# EAGLE design placa_alimentacao (EAGLE 9.1.3)
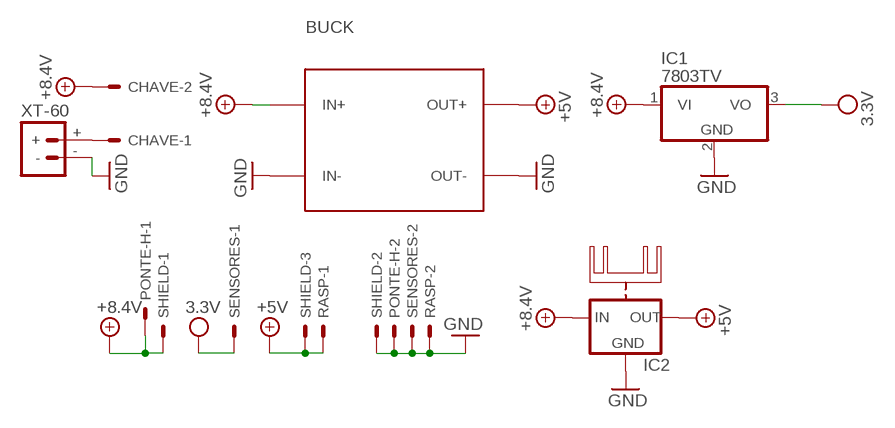
[diagram p0: schematic, sheet 1]

## Parts
BUCK  DC-DC-STEP-DOWN-LM2596  [DC-DC-STEP-DOWN-LM2596]
CHAVE  CONN_0227-2021  [6410-02]
IC1  7803TV  7805TV  [TO220V]
IC2  78XXH  [78XXH]
PONTE-H  CONN_0227-2021  [6410-02]
RASP  CONN_0227-2021  [6410-02]
SENSORES  CONN_0227-2021  [6410-02]
SHIELD  CONN_0327-2031  [6410-03]
XT-60  BATTERY_CONNXT60  [XT60]

## Nets
+5V: BUCK.OUT+ IC2.OUT RASP.1 SHIELD.3
+8V: BUCK.IN+ CHAVE.2 IC1.1(VI) IC2.IN PONTE-H.1 SHIELD.1 ; supply symbol labelled +8.4V
GND: BUCK.IN- BUCK.OUT- IC1.2(GND) IC2.GND PONTE-H.2 RASP.2 SENSORES.2 SHIELD.2 XT-60.-
N$1: CHAVE.1 XT-60.+
VCC: IC1.3(VO) SENSORES.1 ; supply symbol labelled 3.3V

## Library data of the parts
BUCK = Robotica-IFRN-SC-powerModulos:DC-DC-STEP-DOWN-LM2596: DC/DC Step-Down Regulator based on LM2596-ADJ chip
CHAVE PONTE-H RASP SENSORES = Robotica-IFRN-SC-conectores:CONN_02: CONNECTOR wire to board 2.54 mm (.1 inch) pitch header; OC_FARNELL: unknown; OC_NEWARK: unknown
IC1 = linear:78*: Positive VOLTAGE REGULATOR Source: http://cache.national.com/ds/LM/LM78L05.pdf http://www.fairchildsemi.com/ds/LM/LM7805.pdf
IC2 = 78xx_with_heatsink:78XXH: VOLTAGE REGULATOR
SHIELD = Robotica-IFRN-SC-conectores:CONN_03: CONNECTOR wire to board 2.54 mm (.1 inch) pitch header; OC_FARNELL: unknown; OC_NEWARK: unknown
XT-60 = Robotica-IFRN-SC-conectores:BATTERY_CONN: Battery Connectors Various footprints for battery connections

## Board
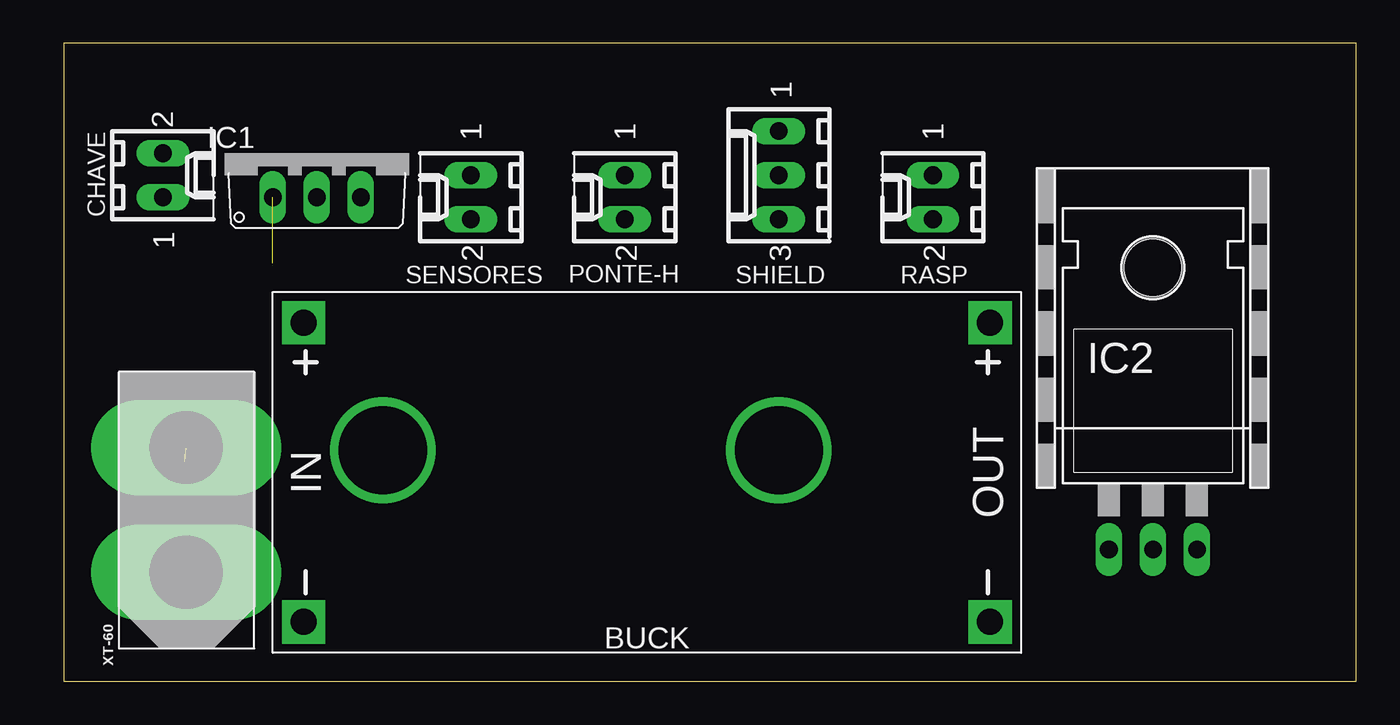
[diagram p1: board, top side]
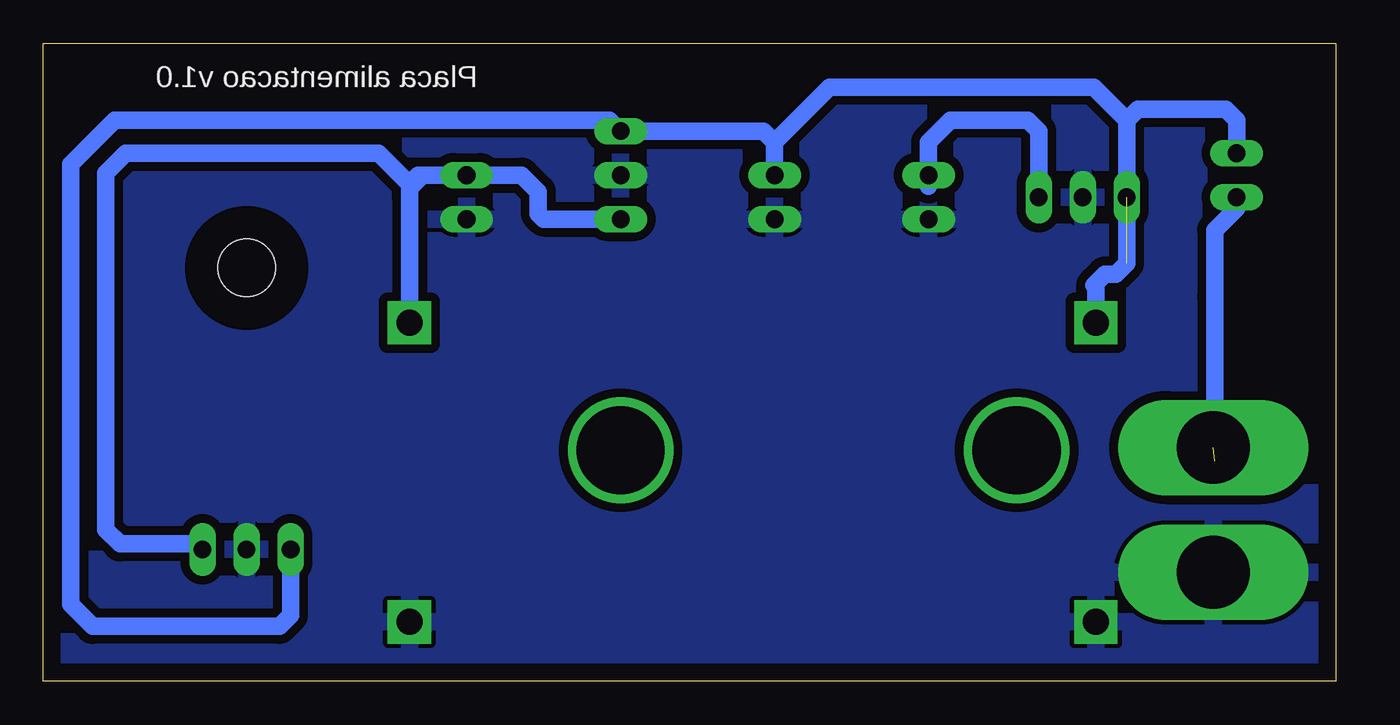
[diagram p2: board, bottom side, seen from below]

Size 74.6 x 36.82 mm. Coordinates in mm from the lower left corner, seen from the top.
Outline: 0,0 74.6,0 74.6,36.82 0,36.82 0,0
Copper layers (1*16): Top 0.035mm / dielectric 1.5mm / Bottom 0.035mm
Design rules "default *": minimum track width 40mil, minimum drill 24mil, track to track 20mil, track to pad 20mil, pad to pad 20mil, via to via 20mil, smd to smd 8mil, copper to edge 40mil, drill to drill 8mil, minimum pad ring 10mil, minimum via ring 8mil, stop-mask expansion 4mil, vias tented up to drill 0mil, thermal gap 10mil

### Footprints (pad centres in the part's own frame; a part is rotated, then mirrored left to right if it is on the bottom)
DC-DC-STEP-DOWN-LM2596 = drill 1.5 pad 2.5 square: IN+ -19.812,8.636; IN- -19.812,-8.636; OUT+ 19.812,8.636; OUT- 19.812,-8.636
6410-02 = drill 1.016 long: 1 1.27,0; 2 -1.27,0
TO220V = drill 1.016 long: 1 -2.54,-2.54; 2 0,-2.54; 3 2.54,-2.54
78XXH = drill 1.016 long: GND 0,-5.08; IN -2.54,-5.08; OUT 2.54,-5.08 | hole 3.302: 0,11.176
6410-03 = drill 1.016 long: 1 2.54,0; 2 0,0; 3 -2.54,0
XT60 = drill 4.2 pad 5.5 long: + 6.51,-1.35; - -0.69,-1.35

### Placement (x,y rotation side)
BUCK  33.66,12.07 0 top
CHAVE  5.71,29.21 270 top
IC1  14.61,30.48 0 top
IC2  62.86,12.7 0 top
PONTE-H  32.38,27.94 90 top
RASP  50.16,27.94 90 top
SENSORES  23.5,27.94 90 top
SHIELD  41.27,29.21 90 top
XT-60  5.71,6.98 90 top

### Tracks (layer width: path | path; a pad name or v marks a point on that pad's centre or on a via)
+5V  (via drill 0.35)
  Top 0.254: v53.47,20.95 BUCK.OUT+
  Bottom 0.254: RASP.1 52.7,29.21 53.47,28.45 | 53.47,28.45 53.47,27.94 | 53.47,28.7 53.47,28.45
  Bottom 1.016: IC2.OUT 65.72,7.94 70.17,7.94 70.99,8.76 70.99,29.34 69.85,30.48 55.24,30.48 53.66,28.89 | 53.66,28.89 53.47,28.7 | 53.47,27.94 v53.47,20.95 | 53.47,27.94 53.47,28.45 | 53.47,28.45 53.47,28.7 | 53.47,28.7 53.66,28.89 | 53.47,28.45 52.7,29.21 52.96,29.21 | 53.47,28.45 53.47,27.94 | 53.47,28.7 52.96,29.21 | 53.47,28.7 52.96,29.21 | 52.96,29.21 RASP.1 46.99,29.21 46.04,28.26 46.04,26.99 45.72,26.67 SHIELD.3
+8V  (1 unrouted)
  Bottom 1.016: IC2.IN 60.32,3.81 60.96,3.18 71.75,3.18 73.02,4.45 73.02,29.85 70.48,32.39 41.91,32.39 SHIELD.1 33.02,31.75 32.38,31.11 | 32.38,31.11 PONTE-H.1 | CHAVE.2 5.71,32.39 6.35,33.02 11.43,33.02 12.07,32.39 | 13.97,20.32 13.97,20.57 BUCK.IN+ 13.84,22.99 | 13.84,22.99 13.34,23.5 12.7,23.5 12.07,24.13 12.07,32.39 | 13.97,22.86 13.84,22.99 | 32.38,31.11 29.21,34.29 13.97,34.29 12.07,32.39
GND
  pour Bottom: 0,36.19 0,0 0.63,0 74.3,0 74.3,36.83 0,36.83
N$1  (1 unrouted)
  Bottom 1.016: 6.98,22.22 6.98,12.7 6.98,26.04 5.71,27.31 CHAVE.1
N$2  (via drill 5.08)
  other vias: 18.41,13.34
N$5  (via drill 5.08)
  other vias: 41.27,13.34
VCC
  Bottom 1.016: IC1.3 17.14,31.75 17.78,32.39 22.23,32.39 23.5,31.11 SENSORES.1 | SENSORES.1 23.5,28.57 SENSORES.1

### Text on the board
bPlace: Placa alimentacao v1.0